# Altium schematic sheet Sheet3.SchDoc
size A4
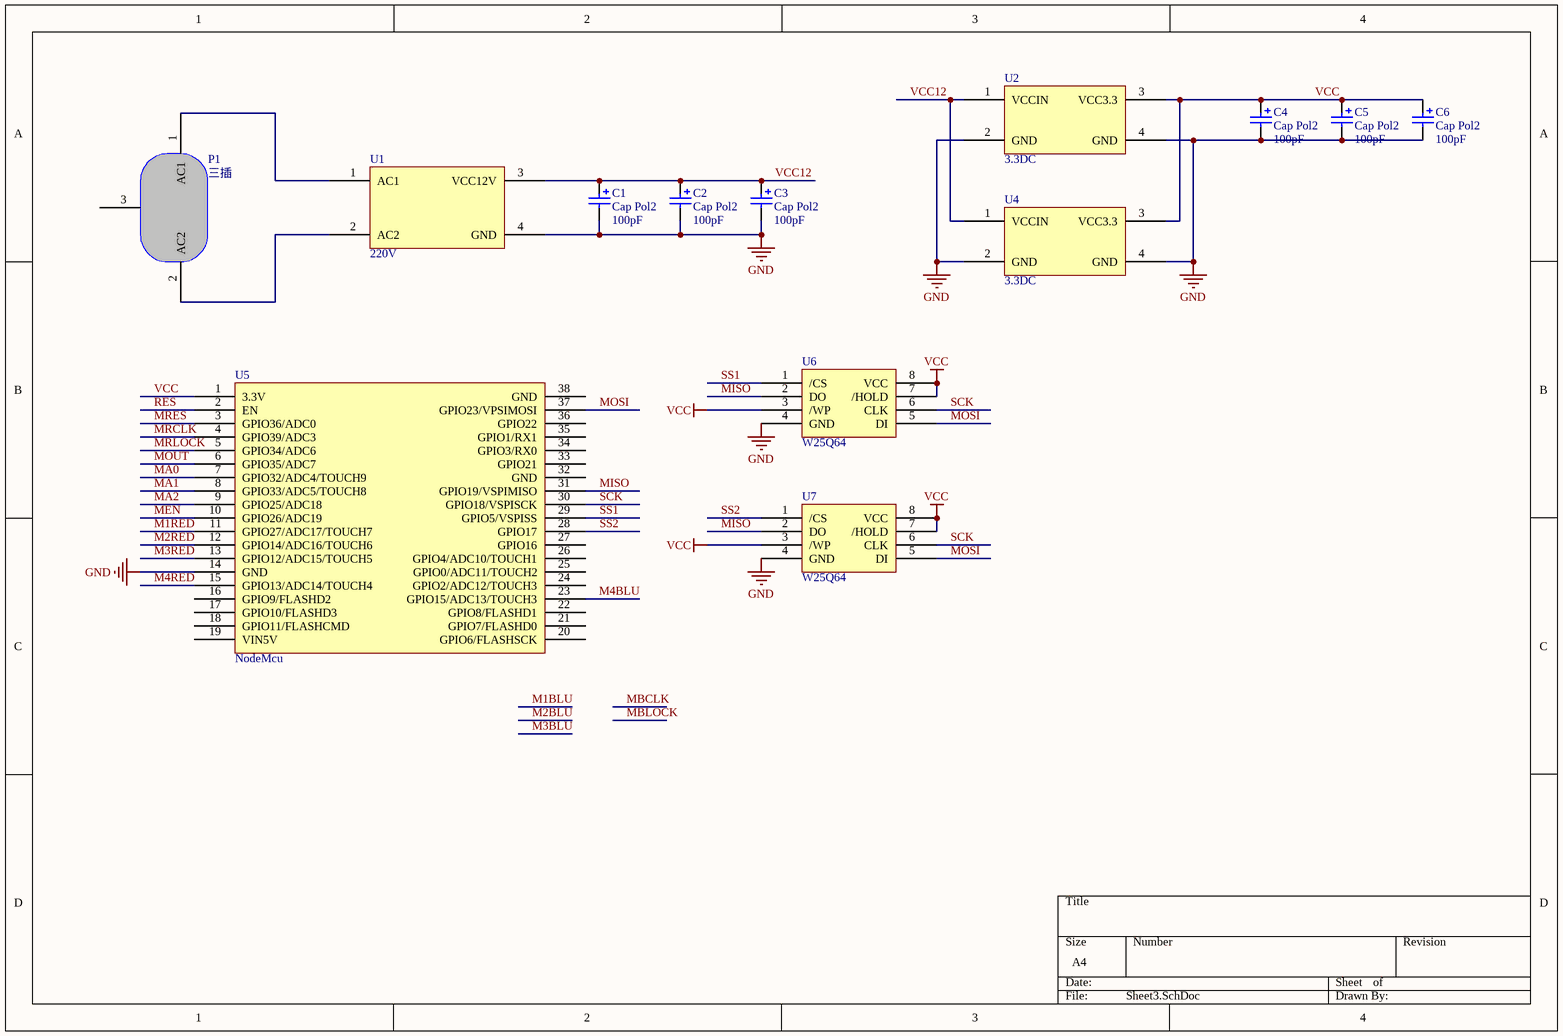
[diagram p0: Sheet3.SchDoc]

## Parts
C1  Cap Pol2  value 100pF  [POLAR0.8]
C2  Cap Pol2  value 100pF  [POLAR0.8]
C3  Cap Pol2  value 100pF  [POLAR0.8]
C4  Cap Pol2  value 100pF  [POLAR0.8]
C5  Cap Pol2  value 100pF  [POLAR0.8]
C6  Cap Pol2  value 100pF  [POLAR0.8]
P1  三插
U1  220V
U2  3.3DC
U4  3.3DC
U5  NodeMcu
U6  W25Q64
U7  W25Q64

## Nets
GND: C1.2 C2.2 C3.2 C4.2 C5.2 C6.2 U1.4(GND) U2.2(GND) U2.4(GND) U4.2(GND) U4.4(GND) U5.14(GND) U6.4(GND) U7.4(GND)
VCC: C4.1 C5.1 C6.1 U2.3(VCC3.3) U4.3(VCC3.3) U5.1(3.3V) U6.3(/WP) U6.7(/HOLD) U6.8(VCC) U7.3(/WP) U7.7(/HOLD) U7.8(VCC)
M1RED: U5.11(GPIO27/ADC17/TOUCH7)
M2RED: U5.12(GPIO14/ADC16/TOUCH6)
M3RED: U5.13(GPIO12/ADC15/TOUCH5)
M4BLU: U5.23(GPIO15/ADC13/TOUCH3)
M4RED: U5.15(GPIO13/ADC14/TOUCH4)
MA0: U5.7(GPIO32/ADC4/TOUCH9)
MA1: U5.8(GPIO33/ADC5/TOUCH8)
MA2: U5.9(GPIO25/ADC18)
MEN: U5.10(GPIO26/ADC19)
MISO: U5.31(GPIO19/VSPIMISO) U6.2(DO) U7.2(DO)
MOSI: U5.37(GPIO23/VPSIMOSI) U6.5(DI) U7.5(DI)
MOUT: U5.6(GPIO35/ADC7)
MRCLK: U5.4(GPIO39/ADC3)
MRES: U5.3(GPIO36/ADC0)
MRLOCK: U5.5(GPIO34/ADC6)
RES: U5.2(EN)
SCK: U5.30(GPIO18/VSPISCK) U6.6(CLK) U7.6(CLK)
SS1: U5.29(GPIO5/VSPISS) U6.1(/CS)
SS2: U5.28(GPIO17) U7.1(/CS)
VCC12: C1.1 C2.1 C3.1 U1.3(VCC12V) U2.1(VCCIN) U4.1(VCCIN)
NetP1_1: P1.1(AC1) U1.1(AC1)
NetP1_2: P1.2(AC2) U1.2(AC2)

Not connected (* = marked no-connect by the designer): P1 3; U5 16(GPIO9/FLASHD2) 17(GPIO10/FLASHD3) 18(GPIO11/FLASHCMD) 19(VIN5V) 20(GPIO6/FLASHSCK) 21(GPIO7/FLASHD0) 22(GPIO8/FLASHD1) 24(GPIO2/ADC12/TOUCH3) 25(GPIO0/ADC11/TOUCH2) 26(GPIO4/ADC10/TOUCH1) 27(GPIO16) 32(GND) 33(GPIO21) 34(GPIO3/RX0) 35(GPIO1/RX1) 36(GPIO22) 38(GND)

## Library data of the parts
P1 = 220V
U1 = AC-DC
U2 U4 = DC-DC
U5 = ESP32S
C1-C6 = Cap Pol2: Published: 8-Jun-2000; LatestRevisionDate: 17-Jul-2002; LatestRevisionNote: Re-released for DXP Platform.; PackageReference: POLAR0.8; Publisher: Altium Limited; PackageDescription: Polarized Capacitor; 2 Leads